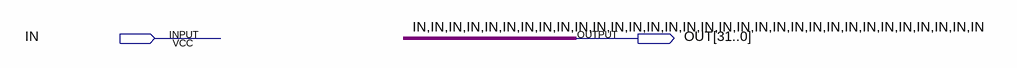
[diagram p0: schematic sheet]
// Quartus schematic ext1_32.bdf as structural Verilog: 0 symbols, 2 pins
module ext1_32 (
  input  IN,
  output [31:0] OUT
);


  assign OUT = {32{IN}};
endmodule
